# Altium schematic sheet power.SchDoc: Power (part 3 of 3)
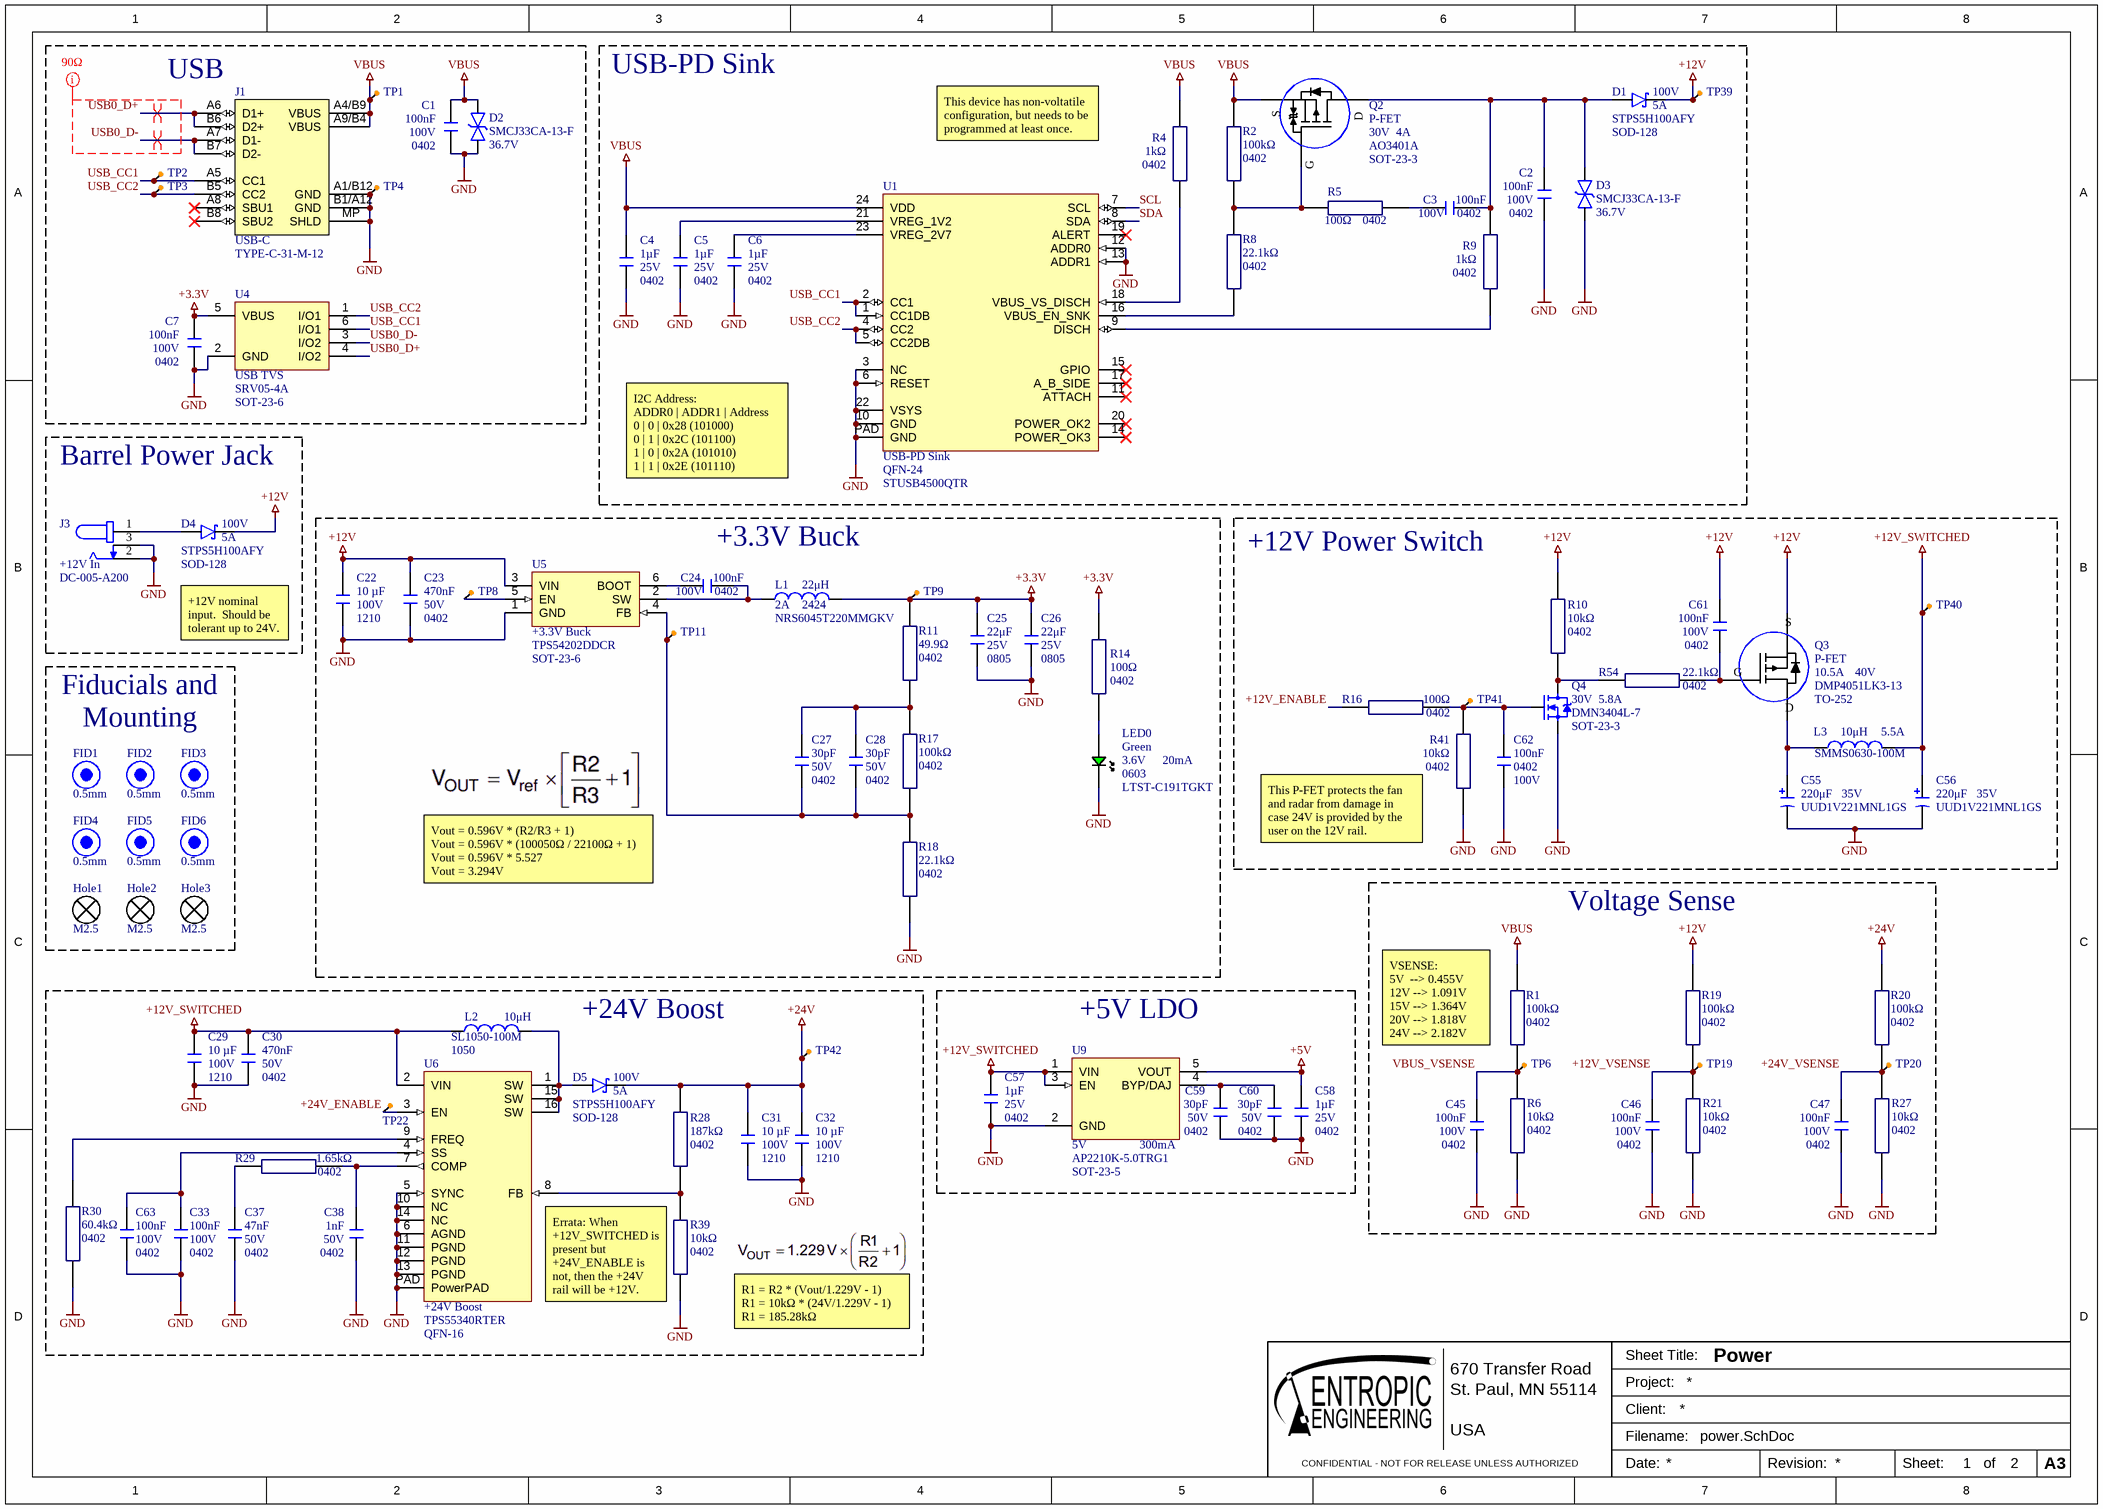
[diagram p2: power.SchDoc]

## Library data of the parts (continued)
R54 = RC0402FR-0722K1L: 22.1 kΩ, 1%, 0402 Resistor; Manufacturer: Yageo; Additional Feature: LASER TRIMMABLE; Power: 62.5mW; Rated Temperature: 70°C; Working Voltage: 50V; Temperature Coefficient (ppm/Cel): 100; Package Height: 0.35mm; Package Length: 1mm; Package Width: 0.5mm; Supplier 1: Digikey; Supplier Part Number 1: 311-22.1KLRCT-ND; RoHS: Yes; Category: Chip SMD Resistors; Stock 1: 259657; Pricing 1: 1=0.1, 10=0.008, 100=0.0061, 1000=0.0051, 10000=0.00123 (USD); Min Operating Temperature: -55°C; Max Operating Temperature: 155°C; Tolerance: 1%; Packaging: Tape and Reel; Resistor Type: FIXED RESISTOR; Construction: Chip; RoHS Compliant: Yes; ComponentLink1URL: https://datasheet.ciiva.com:443/pdfs/VipMasterIC/IC/YAGO/YAGO-S-A0008145938/YAGO-S-A0008145938-1.pdf?src-supplier=IHS+Markit; ComponentLink1Description: https://datasheet.ciiva.com:443/pdfs/VipMasterIC/IC/YAGO/YAGO-S-A0008145938/YAGO-S-A0008145938-1.pdf?src-supplier=IHS+Markit; ComponentLink2URL: https://datasheet.ciiva.com/2553/pyu-r-int-thick-7-2553200.pdf?src-supplier=Digikey; ComponentLink2Description: https://datasheet.ciiva.com/2553/pyu-r-int-thick-7-2553200.pdf?src-supplier=Digikey; ComponentLink3URL: https://datasheet.ciiva.com/2553/pyu-r-int-thick-7-2553201.pdf?src-supplier=Digikey; ComponentLink3Description: https://datasheet.ciiva.com/2553/pyu-r-int-thick-7-2553201.pdf?src-supplier=Digikey; ComponentLink4URL: https://datasheet.ciiva.com/2553/pyu-r-int-thick-7-2553202.pdf?src-supplier=Digikey; ComponentLink4Description: https://datasheet.ciiva.com/2553/pyu-r-int-thick-7-2553202.pdf?src-supplier=Digikey; ComponentLink5URL: https://datasheet.ciiva.com/15189/getdatasheetpartid-251817-15189388.pdf?src-supplier=Verical; ComponentLink5Description: https://datasheet.ciiva.com/15189/getdatasheetpartid-251817-15189388.pdf?src-supplier=Verical; Manufacturer Part Number: RC0402FR-0722K1L; Mounting Technology: Surface Mount; Pins: 2; Package Shape: Rectangular; Terminal Finish: Nickel; JESD-609 Code: e3; Technology: METAL GLAZE/THICK FILM; Termination: Wraparound; Reach SVHC Compliant: Yes; ComponentLink6URL: https://datasheet.ciiva.com/7983/1018594-7983501.pdf?src-supplier=Element14; ComponentLink6Description: https://datasheet.ciiva.com/7983/1018594-7983501.pdf?src-supplier=Element14
TP1-TP4 TP6 TP8 TP9 TP11 TP19 TP20 TP22 TP39-TP42 = test_point-1: Test point; pickable: no
U1 = STUSB4500QTR: USB PD Sink; Manufacturer: STMicroelectronics; Consumer IC Type: CONSUMER CIRCUIT; Supplier 1: LCSC; RoHS: Yes; Category: USB Interface ICs; Stock 1: 9434; Pricing 1: 1=1.8642, 10=1.5172, 30=1.3685, 100=1.183, 1000=1.0509, 2000=1.0343 (USD); Reach SVHC Compliant: Yes; RoHS Compliant: Yes; ComponentLink1URL: https://datasheet.ciiva.com:443/pdfs/VipMasterIC/IC/SGST/SGST-S-A0009451278/SGST-S-A0009451278-1.pdf?src-supplier=IHS+Markit; ComponentLink1Description: https://datasheet.ciiva.com:443/pdfs/VipMasterIC/IC/SGST/SGST-S-A0009451278/SGST-S-A0009451278-1.pdf?src-supplier=IHS+Markit; ComponentLink2URL: http://www.farnell.com/datasheets/2710898.pdf?src-supplier=Farnell; ComponentLink2Description: http://www.farnell.com/datasheets/2710898.pdf?src-supplier=Farnell; ComponentLink3URL: http://www.farnell.com/datasheets/2710898.pdf?src-supplier=Element14; ComponentLink3Description: http://www.farnell.com/datasheets/2710898.pdf?src-supplier=Element14; ComponentLink4URL: http://www.farnell.com/datasheets/2710898.pdf?src-supplier=Newark; ComponentLink4Description: http://www.farnell.com/datasheets/2710898.pdf?src-supplier=Newark; ComponentLink5URL: http://www.st.com/content/ccc/resource/technical/document/datasheet/group3/1c/4a/55/d7/17/01/44/86/DM00489312/files/DM00489312.pdf/jcr:content/translations/en.DM00489312.pdf?src-supplier=Digikey; ComponentLink5Description: http://www.st.com/content/ccc/resource/technical/document/datasheet/group3/1c/4a/55/d7/17/01/44/86/DM00489312/files/DM00489312.pdf/jcr:content/translations/en.DM00489312.pdf?src-supplier=Digikey; Supplier Part Number 1: C2678061; Package: QFN-24; Manufacturer Part Number: STUSB4500QTR
U4 = SRV05-4A: TVS DIODE ARRAY SOT23-6; Manufacturer: SMC Diodes; Direction: Unidirectional,Bidirectional; Capacitance: 3.5pF; Operating Supply Voltage: 1.1V; Number of Channels: 2; Breakdown Voltage: 6V; Clamping Voltage: 17V; Reverse Standoff Voltage: 5.25V; Power Line Protection: Yes; Test Current: 1mA; Max Reverse Leakage Current: 150nA; Peak Pulse Current: 5A; Element Configuration: Dual; Data Rate: 480Mbps; Number of Elements: 1; Working Voltage: 5V; RoHS: Yes; Category: TVS Diodes; Stock: 12000; Pricing: 3000=0,05640 (USD); Mount: Surface Mount; Number of Pins: 6; Contact Plating: Tin,Matte; Min Operating Temperature: -40°C; Max Operating Temperature: 125°C; Packaging: Tape and Reel; Package Quantity: 3000; Termination: SMD/SMT; Number of Bidirectional Channels: 2; Min Breakdown Voltage: 6V; ESD Protection: Yes; Leakage Current: 150nA; Series: USB; Reverse Breakdown Voltage: 6V; Polarity: Unidirectional,Bidirectional; Max Breakdown Voltage: 6V; Clamping Voltage-Max: 17V; Length: 3.05mm; Width: 1.75mm; Height: 1.3mm; Depth: 1.75mm; Radiation Hardening: No; REACH SVHC: No SVHC; Lead Free: Lead Free; RoHS Compliant: Yes; ComponentLink1URL: https://datasheet.ciiva.com/1268/1690354-1268384.pdf?src-supplier=Element14; ComponentLink1Description: https://datasheet.ciiva.com/1268/1690354-1268384.pdf?src-supplier=Element14; ComponentLink2URL: https://datasheet.ciiva.com/4508/cd00050750-113117-4508433.pdf?src-supplier=Mouser; ComponentLink2Description: https://datasheet.ciiva.com/4508/cd00050750-113117-4508433.pdf?src-supplier=Mouser; ComponentLink3URL: https://datasheet.ciiva.com/15143/getdatasheetpartid-148465-15143789.pdf?src-supplier=Verical; ComponentLink3Description: https://datasheet.ciiva.com/15143/getdatasheetpartid-148465-15143789.pdf?src-supplier=Verical; ComponentLink4URL: https://datasheet.ciiva.com/16200/cd00050750-16200026.pdf?src-supplier=Future+Electronics; ComponentLink4Description: https://datasheet.ciiva.com/16200/cd00050750-16200026.pdf?src-supplier=Future+Electronics; ComponentLink5URL: https://datasheet.ciiva.com/41444/001184109-da-01-en-ic-esd-protecti-usblc6-2sc6-sot-23-6-stm-41444156.pdf?src-supplier=Conrad; ComponentLink5Description: https://datasheet.ciiva.com/41444/001184109-da-01-en-ic-esd-protecti-usblc6-2sc6-sot-23-6-stm-41444156.pdf?src-supplier=Conrad; Supplier 1: LCSC; Supplier Part Number 1: C260410; Manufacturer Part Number: SRV05-4A; house_part_number: SRV05-4A
U5 = TPS54202DDCR: Switching Regulator, Current-mode, 2A, 500kHz Switching Freq-Max, PDSO6; Manufacturer: Texas Instruments; Package Body Material: Plastic; Control Technique: PULSE WIDTH MODULATION; Max Supply Voltage: 28V; Min Input Voltage: 4.5V; Nominal Supply Voltage: 12V; Channels: 1; Max Output current: 3.9A; Frequency: 590kHz; Supplier 1: Digi-Key; RoHS: Yes; Category: Voltage Regulators - Switching; Stock 1: 4766; Pricing 1: 1=1.29, 10=1.154, 25=1.0956, 100=0.9001, 250=0.8414, 500=0.74356, 1000=0.58702 (USD); Pins: 6; Package Shape: Rectangular; Terminal Finish: Tin; Min Operating Temperature: -40°C; Max Operating Temperature: 125°C; JESD-609 Code: e3; Throw Configuration: SWITCHING REGULATOR; Control Mode: CURRENT-MODE; JESD-30 Code: R-PDSO-G6; Moisture Sensitivity Level: 1; Package Style: SMALL OUTLINE, THIN PROFILE, SHRINK PITCHMeter; Surface Mount: Yes; Switcher Configuration: BUCK; Terminal Form: Gull Wing; Terminal Position: DUAL; Length: 2.9mm; Width: 1.6mm; Height - Seated (Max): 1.1mm; Terminal Pitch: 0.95mm; Temperature Grade: AUTOMOTIVE; Reach SVHC Compliant: Yes; RoHS Compliant: Yes; ComponentLink1URL: https://www.ti.com:443/lit/ds/symlink/tps54202.pdf?src-supplier=IHS+Markit; ComponentLink1Description: https://www.ti.com:443/lit/ds/symlink/tps54202.pdf?src-supplier=IHS+Markit; ComponentLink2URL: http://www.ti.com/general/docs/suppproductinfo.tsp?distId=10&gotoUrl=http%3A%2F%2Fwww.ti.com%2Flit%2Fgpn%2Ftps54202&src-supplier=Digi-Key; ComponentLink2Description: http://www.ti.com/general/docs/suppproductinfo.tsp?distId=10&gotoUrl=http%3A%2F%2Fwww.ti.com%2Flit%2Fgpn%2Ftps54202&src-supplier=Digi-Key; ComponentLink3URL: http://www.ti.com/lit/ds/symlink/tps54202.pdf?src-supplier=Digi-Key; ComponentLink3Description: http://www.ti.com/lit/ds/symlink/tps54202.pdf?src-supplier=Digi-Key; ComponentLink4URL: http://www.ti.com/general/docs/suppproductinfo.tsp?distId=10&amp;gotoUrl=http%3A%2F%2Fwww.ti.com%2Flit%2Fgpn%2Ftps54202&src-supplier=Digi-Key; ComponentLink4Description: http://www.ti.com/general/docs/suppproductinfo.tsp?distId=10&amp;gotoUrl=http%3A%2F%2Fwww.ti.com%2Flit%2Fgpn%2Ftps54202&src-supplier=Digi-Key; Supplier Part Number 1: 296-TPS54202DDCRDKR-ND; Case/Package: SOT-23-6; Manufacturer Part Number: TPS54202DDCR
U6 = TPS55340RTER: Boost, 32V, 7.75A, QFN-16; Manufacturer: Texas Instruments; Package Body Material: Plastic; Throw Configuration: SWITCHING REGULATOR; Control Mode: CURRENT-MODE; Control Technique: PULSE WIDTH MODULATION; Min Input Voltage: 2.9V; Nominal Supply Voltage: 5V; Channels: 1; Frequency: 1.48MHz; Qualification Status: Not Qualified; Supplier 1: LCSC; RoHS: Yes; Category: Voltage Regulators - Switching; Stock 1: 2560; Pricing 1: 1=0.8828, 10=0.7582, 30=0.6705, 100=0.5967, 500=0.5168, 1000=0.5029 (USD); Case/Package: HVQCCN; Pins: 16; Package Shape: Square; Terminal Finish: Nickel; Min Operating Temperature: -40°C; Max Operating Temperature: 150°C; JESD-609 Code: e4; Max Supply Voltage: 32V; JESD-30 Code: S-PQCC-N16; Moisture Sensitivity Level: 2; Max Output current: 7.75A; Package Style: CHIP CARRIER, HEAT SINK/SLUG, VERY THIN PROFILEMeter; Peak Reflow Temperature (Cel): 260°C; Surface Mount: Yes; Switcher Configuration: BOOST; Terminal Form: No Lead; Terminal Position: QUAD; Length: 3mm; Width: 3mm; Height - Seated (Max): 0.8mm; Terminal Pitch: 0.5mm; Temperature Grade: AUTOMOTIVE; Reach SVHC Compliant: Yes; RoHS Compliant: Yes; ComponentLink1URL: https://www.ti.com:443/lit/ds/symlink/tps55340.pdf?src-supplier=IHS+Markit; ComponentLink1Description: https://www.ti.com:443/lit/ds/symlink/tps55340.pdf?src-supplier=IHS+Markit; ComponentLink2URL: https://datasheet.ciiva.com/41798/tps55340-41798808.pdf?src-supplier=Digikey; ComponentLink2Description: https://datasheet.ciiva.com/41798/tps55340-41798808.pdf?src-supplier=Digikey; ComponentLink3URL: https://datasheet.ciiva.com/14377/tps55340-14377094.pdf?src-supplier=Avnet; ComponentLink3Description: https://datasheet.ciiva.com/14377/tps55340-14377094.pdf?src-supplier=Avnet; Supplier Part Number 1: C169167; Manufacturer Part Number: TPS55340RTER
U9 = AP2210K-5.0TRG1: 5 V, 300 mA LDO, SOT-23-5; Manufacturer: Diodes; Package Body Material: Plastic; Dropout Voltage1-Max: 500mV; Max Supply Voltage: 13.2V; Min Input Voltage: 6V; Channels: 1; Output Voltage1-Max: 5.1V; Output Voltage1-Min: 4.9V; Regulator Type: FIXED POSITIVE SINGLE OUTPUT LDO REGULATOR; Supplier 1: LCSC; RoHS: Yes; Category: Voltage Regulators - Linear; Stock 1: 4255; Pricing 1: 5=0.1337, 50=0.1058, 150=0.0919, 500=0.0815, 3000=0.0657, 6000=0.0615 (USD); Pins: 5; Package Shape: Rectangular; Terminal Finish: Tin; JESD-609 Code: e3; JESD-30 Code: R-PDSO-G5; Moisture Sensitivity Level: 3; Operating Temperature, TJ-Max: 125°C; Operating Temperature, TJ-Min: -40°C; Package Style: SMALL OUTLINE, LOW PROFILE, SHRINK PITCHMeter; Surface Mount: Yes; Terminal Form: Gull Wing; Terminal Position: DUAL; Length: 2.9mm; Width: 1.6mm; Height - Seated (Max): 1.45mm; Terminal Pitch: 0.95mm; Reach SVHC Compliant: Yes; RoHS Compliant: Yes; ComponentLink1URL: https://datasheet.ciiva.com:443/pdfs/VipMasterIC/IC/DIOD/DIOD-S-A0002238385/DIOD-S-A0002238385-1.pdf?src-supplier=IHS+Markit; ComponentLink1Description: https://datasheet.ciiva.com:443/pdfs/VipMasterIC/IC/DIOD/DIOD-S-A0002238385/DIOD-S-A0002238385-1.pdf?src-supplier=IHS+Markit; ComponentLink2URL: https://datasheet.ciiva.com/29569/ap2210-29569974.pdf?src-supplier=Digikey; ComponentLink2Description: https://datasheet.ciiva.com/29569/ap2210-29569974.pdf?src-supplier=Digikey; ComponentLink3URL: https://datasheet.ciiva.com/29569/ap2210-29569975.pdf?src-supplier=Digikey; ComponentLink3Description: https://datasheet.ciiva.com/29569/ap2210-29569975.pdf?src-supplier=Digikey; ComponentLink4URL: https://datasheet.ciiva.com/29569/ap2210-29569976.pdf?src-supplier=Digikey; ComponentLink4Description: https://datasheet.ciiva.com/29569/ap2210-29569976.pdf?src-supplier=Digikey; Supplier Part Number 1: C500758; Case/Package: SOT-23-5; Manufacturer Part Number: AP2210K-5.0TRG1